# EAGLE board untitled (EAGLE 9.5.2), part 1 of 3
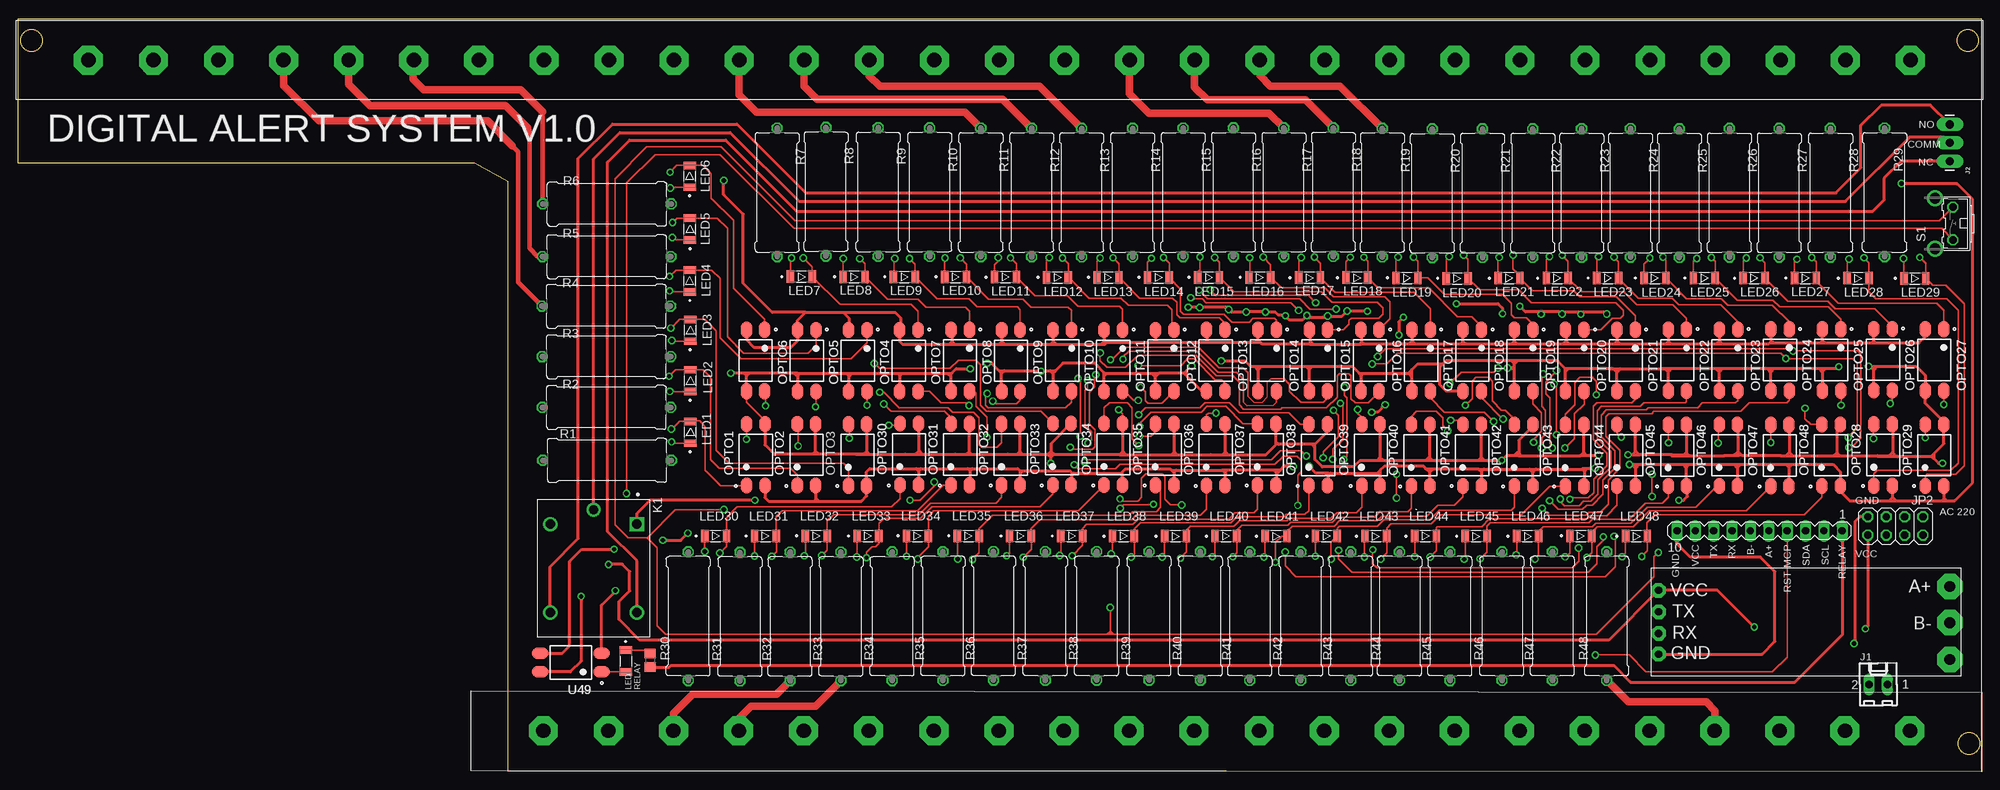
[diagram p1: board, top side]
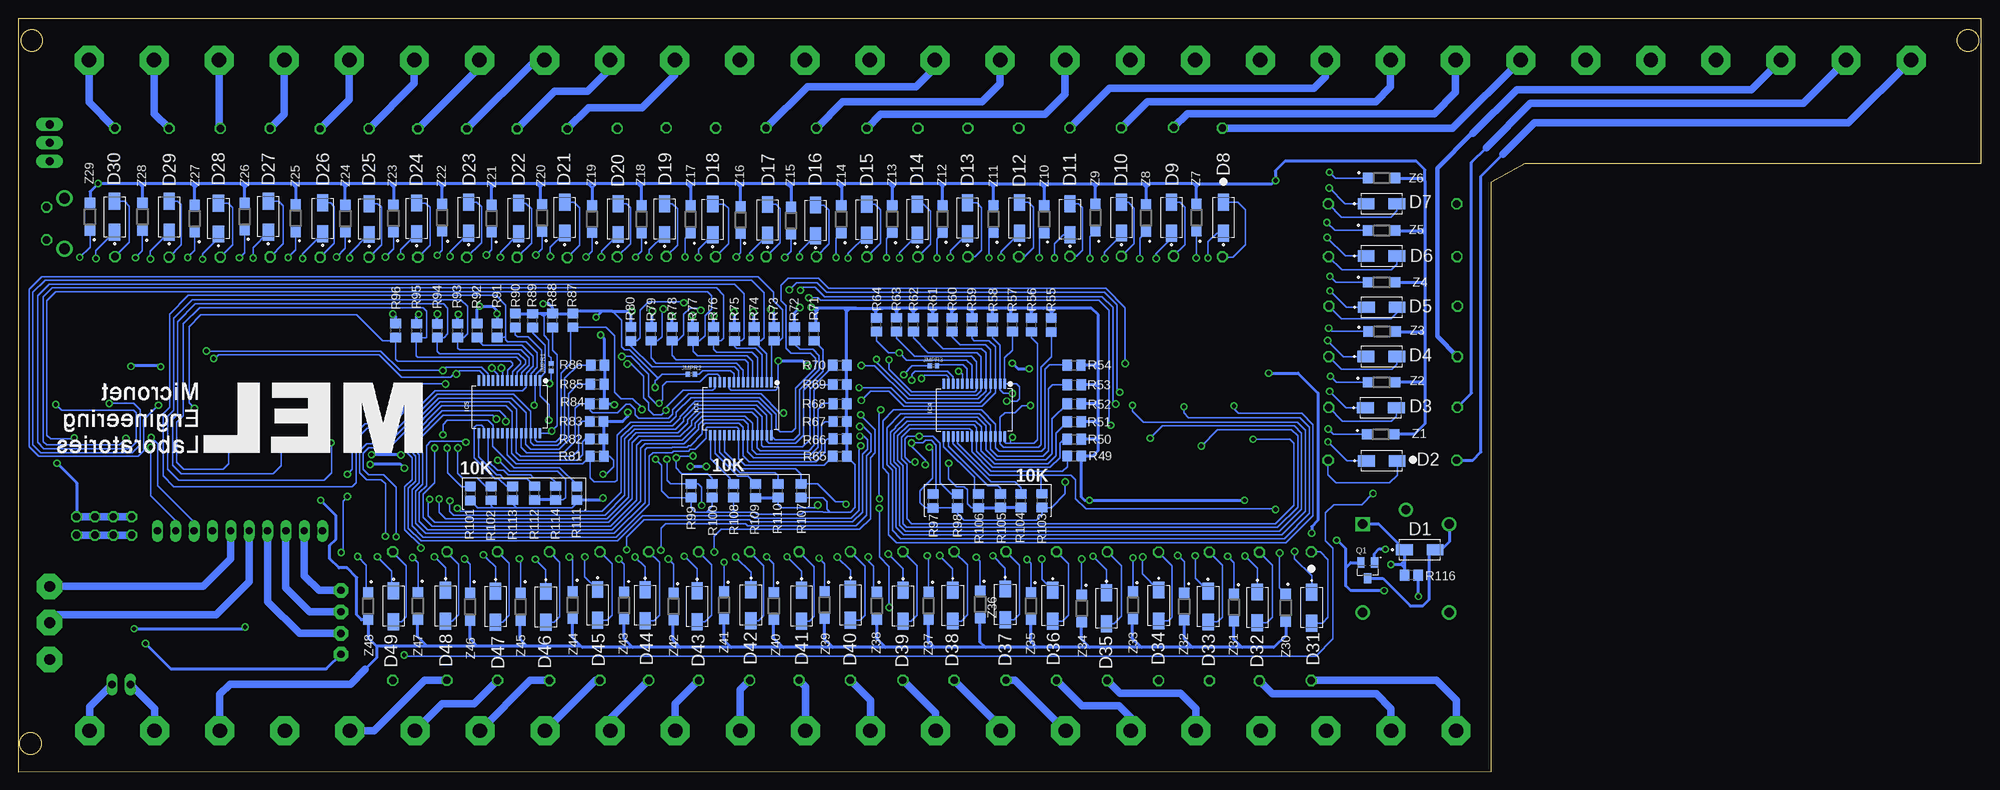
[diagram p2: board, bottom side, seen from below]

Size 271.53 x 104.18 mm. Coordinates in mm from the lower left corner, seen from the top.
Outline: 271.51,104.18 271.52,104.18
Outline: 0,104.13 271.53,104.13 271.53,0 67.78,0.08 67.81,81.59 63.11,84.1 0.02,84.1 0,104.13
Outline: circle at 269.84,3.87 radius 1.48
Outline: circle at 269.64,101.07 radius 1.48
Outline: circle at 1.84,101.07 radius 1.48
Copper layers (1*16): Top 0.035mm / dielectric 1.5mm / Bottom 0.035mm
Design rules "default *": minimum track width 6mil, minimum drill 0.35mm, track to track 0.3mm, track to pad 0.3mm, pad to pad 0.3mm, via to via 0.3mm, smd to smd 6mil, copper to edge 40mil, drill to drill 0.3mm, minimum pad ring 10mil, minimum via ring 8mil, stop-mask expansion 4mil, vias tented up to drill 25mil, thermal gap 10mil
Net classes: 0 default: drill 0.6 mm, clearance 0.3 mm

## Footprints (pad centres in the part's own frame; a part is rotated, then mirrored left to right if it is on the bottom)
DIOM5226X240N = smd 2.33 x 1.55: A 2.135,0; C -2.135,0
LEDC3216X120N = smd 1.01 x 1.73: + -1.51,0; - 1.51,0
HEADER-29P = drill 2 pad 4 octagon: 1 -109,16.5; 2 -100,16.5; 3 -91,16.5; 4 -82,16.5; 5 -73,16.5; 6 -64,16.5; 7 -55,16.5; 8 -46,16.5; 9 -37,16.5; 10 -28,16.5; 11 -19,16.5; 12 -10,16.5; 13 -1,16.5; 14 8,16.5; 15 17,16.5; 16 26,16.5; 17 35,16.5; 18 44,16.5; 19 53,16.5; 20 62,16.5; 21 71,16.5; 22 80,16.5
HEADER-29P' = drill 2 pad 4 octagon: 1 -116.62,5.07; 2 -107.62,5.07; 3 -98.62,5.07; 4 -89.62,5.07; 5 -80.62,5.07; 6 -71.62,5.07; 7 -62.62,5.07; 8 -53.62,5.07; 9 -44.62,5.07; 10 -35.62,5.07; 11 -26.62,5.07; 12 -17.62,5.07; 13 -8.62,5.07; 14 0.38,5.07; 15 9.38,5.07; 16 18.38,5.07; 17 27.38,5.07; 18 36.38,5.07; 19 45.38,5.07; 20 54.38,5.07; 21 63.38,5.07; 22 72.38,5.07; 23 81.38,5.07; 24 90.38,5.07; 25 99.38,5.07; 26 108.38,5.07; 27 117.38,5.07; 28 126.38,5.07; 29 135.38,5.07
SSOP28DB = smd 0.348 x 1.397: 1 -4.225,-3.656; 2 -3.575,-3.656; 3 -2.925,-3.656; 4 -2.275,-3.656; 5 -1.625,-3.656; 6 -0.975,-3.656; 7 -0.325,-3.656; 8 0.325,-3.656; 9 0.975,-3.656; 10 1.625,-3.656; 11 2.275,-3.656; 12 2.925,-3.656; 13 3.575,-3.656; 14 4.225,-3.656; 15 4.225,3.656; 16 3.575,3.656; 17 2.925,3.656; 18 2.275,3.656; 19 1.625,3.656; 20 0.975,3.656; 21 0.325,3.656; 22 -0.325,3.656; 23 -0.975,3.656; 24 -1.625,3.656; 25 -2.275,3.656; 26 -2.925,3.656; 27 -3.575,3.656; 28 -4.225,3.656
6410-02 = drill 1.016 long: 1 1.27,0; 2 -1.27,0
1X03_LONGPADS = drill 1.118 pad 1.88 long: 1 0,0; 2 2.54,0; 3 5.08,0
R0402 = smd 0.6 x 0.7: 1 -0.5,0; 2 0.5,0
2X04 = drill 1.016 octagon: 1 -3.81,-1.27; 2 -3.81,1.27; 3 -1.27,-1.27; 4 -1.27,1.27; 5 1.27,-1.27; 6 1.27,1.27; 7 3.81,-1.27; 8 3.81,1.27
RELAY_SRD-05VDC-SL-C = drill 1.32 square: A1 -6.1,6 | drill 1.32: A2 -6.1,-6; NC 6.1,6; NO 6.1,-6 | drill 1.29: COM -8.1,0
SOT254P975X400-4N = smd 2.25 x 1.6: 1 -4.25,1.27; 2 -4.25,-1.27; 3 4.25,-1.27; 4 4.25,1.27
SOT95P240X120-3N = smd 1 x 1.4: 1 -0.95,-1.1; 2 0.95,-1.1; 3 0,1.1
0617/17 = drill 1.016 octagon: 1 -8.89,0; 2 8.89,0
R0805 = smd 1.3 x 1.5: 1 -0.95,0; 2 0.95,0
B3F-31XX = drill 1.016 octagon: 1 -2.261,-1.245; 2 2.261,-1.245 | drill 1.499 pad 2.159: 3 -3.505,1.245; 4 3.505,1.245
MA10-1 = drill 1.016 long: 1 -11.43,0; 2 -8.89,0; 3 -6.35,0; 4 -3.81,0; 5 -1.27,0; 6 1.27,0; 7 3.81,0; 8 6.35,0; 9 8.89,0; 10 11.43,0
TTL-RS485 = drill 1.5 pad 3.5 octagon: A -19.7,-6; B -19.7,-1; P$7 -19.7,4.1 | drill 1 pad 2 octagon: GND 20.6,3.37; RX 20.581,0.505; TX 20.583,-2.493; VCC 20.6,-5.47
SOD123 = smd 1.4 x 1.4: A 1.9,0; C -1.9,0

## Placement (x,y rotation side)
D1  US1M-13  [DIOM5226X240N]  77.69,30.68 0 bottom
D2  US1M-13  [DIOM5226X240N]  82.93,42.95 0 bottom
D3  US1M-13  [DIOM5226X240N]  83.06,50.31 0 bottom
D4  US1M-13  [DIOM5226X240N]  82.98,57.39 0 bottom
D5  US1M-13  [DIOM5226X240N]  82.94,64.2 0 bottom
D6  US1M-13  [DIOM5226X240N]  82.96,71.29 0 bottom
D7  US1M-13  [DIOM5226X240N]  82.95,78.53 0 bottom
D8  US1M-13  [DIOM5226X240N]  104.82,76.59 90 bottom
D9  US1M-13  [DIOM5226X240N]  112,76.59 90 bottom
D10  US1M-13  [DIOM5226X240N]  118.95,76.59 90 bottom
D11  US1M-13  [DIOM5226X240N]  126.07,76.37 90 bottom
D12  US1M-13  [DIOM5226X240N]  133.03,76.55 90 bottom
D13  US1M-13  [DIOM5226X240N]  140.23,76.51 90 bottom
D14  US1M-13  [DIOM5226X240N]  147.16,76.32 90 bottom
D15  US1M-13  [DIOM5226X240N]  154.17,76.3 90 bottom
D16  US1M-13  [DIOM5226X240N]  161.24,76.2 90 bottom
D17  US1M-13  [DIOM5226X240N]  167.87,76.27 90 bottom
D18  US1M-13  [DIOM5226X240N]  175.46,76.34 90 bottom
D19  US1M-13  [DIOM5226X240N]  182.11,76.39 90 bottom
D20  US1M-13  [DIOM5226X240N]  188.54,76.39 90 bottom
D21  US1M-13  [DIOM5226X240N]  195.92,76.6 90 bottom
D22  US1M-13  [DIOM5226X240N]  202.31,76.48 90 bottom
D23  US1M-13  [DIOM5226X240N]  209.2,76.58 90 bottom
D24  US1M-13  [DIOM5226X240N]  216.42,76.48 90 bottom
D25  US1M-13  [DIOM5226X240N]  223,76.4 90 bottom
D26  US1M-13  [DIOM5226X240N]  229.42,76.5 90 bottom
D27  US1M-13  [DIOM5226X240N]  236.92,76.73 90 bottom
D28  US1M-13  [DIOM5226X240N]  243.83,76.47 90 bottom
D29  US1M-13  [DIOM5226X240N]  250.62,76.71 90 bottom
D30  US1M-13  [DIOM5226X240N]  258.19,76.7 90 bottom
D31  US1M-13  [DIOM5226X240N]  92.62,22.66 270 bottom
D32  US1M-13  [DIOM5226X240N]  100.15,22.7 270 bottom
D33  US1M-13  [DIOM5226X240N]  106.95,22.82 270 bottom
D34  US1M-13  [DIOM5226X240N]  113.78,22.96 270 bottom
D35  US1M-13  [DIOM5226X240N]  121.02,22.58 270 bottom
D36  US1M-13  [DIOM5226X240N]  128.43,22.94 270 bottom
D37  US1M-13  [DIOM5226X240N]  135.01,23.11 270 bottom
D38  US1M-13  [DIOM5226X240N]  142.27,22.95 270 bottom
D39  US1M-13  [DIOM5226X240N]  149.14,22.92 270 bottom
D40  US1M-13  [DIOM5226X240N]  156.43,23.05 270 bottom
D41  US1M-13  [DIOM5226X240N]  163.19,22.92 270 bottom
D42  US1M-13  [DIOM5226X240N]  170.19,23.01 270 bottom
D43  US1M-13  [DIOM5226X240N]  177.63,22.85 270 bottom
D44  US1M-13  [DIOM5226X240N]  184.83,23 270 bottom
D45  US1M-13  [DIOM5226X240N]  191.37,23.05 270 bottom
D46  US1M-13  [DIOM5226X240N]  198.54,22.77 270 bottom
D47  US1M-13  [DIOM5226X240N]  205.51,22.8 270 bottom
D48  US1M-13  [DIOM5226X240N]  212.42,22.92 270 bottom
D49  US1M-13  [DIOM5226X240N]  219.61,22.87 270 bottom
D146  LHN974_RED_LED_1206  [LEDC3216X120N]  84.03,15.28 270 top
HEADER-22P1  [HEADER-29P]  181.65,-10.85 0 top
HEADER-29P1  [HEADER-29P']  126.34,93.31 0 top
IC1  MCP23017SS  [SSOP28DB]  171.57,50.18 180 bottom
IC4  MCP23017SS  [SSOP28DB]  139.3,49.98 180 bottom
IC5  MCP23017SS  [SSOP28DB]  203.57,50.42 180 bottom
J1  22-27-2021-02  [6410-02]  257.26,12.06 0 top
J2  [1X03_LONGPADS]  267.16,84.39 90 top
JMPR1  [R0402]  197.83,55.9 270 bottom
JMPR2  [R0402]  178.42,54.94 0 bottom
JMPR3  [R0402]  144.94,56.11 0 bottom
JP2  [2X04]  259.64,33.96 0 top
K1  SRD-05VDC-SL-C  [RELAY_SRD-05VDC-SL-C]  79.6,28.1 270 top
LED1  LHN974_RED_LED_1206  [LEDC3216X120N]  92.95,46.9 90 top
LED2  LHN974_RED_LED_1206  [LEDC3216X120N]  92.96,54.06 90 top
LED3  LHN974_RED_LED_1206  [LEDC3216X120N]  92.95,61 90 top
LED4  LHN974_RED_LED_1206  [LEDC3216X120N]  92.9,67.84 90 top
LED5  LHN974_RED_LED_1206  [LEDC3216X120N]  92.92,75.01 90 top
LED6  LHN974_RED_LED_1206  [LEDC3216X120N]  92.88,82.29 90 top
LED7  LHN974_RED_LED_1206  [LEDC3216X120N]  108.32,68.43 0 top
LED8  LHN974_RED_LED_1206  [LEDC3216X120N]  115.62,68.42 0 top
LED9  LHN974_RED_LED_1206  [LEDC3216X120N]  122.57,68.39 0 top
LED10  LHN974_RED_LED_1206  [LEDC3216X120N]  129.65,68.4 0 top
LED11  LHN974_RED_LED_1206  [LEDC3216X120N]  136.56,68.36 0 top
LED12  LHN974_RED_LED_1206  [LEDC3216X120N]  143.74,68.34 0 top
LED13  LHN974_RED_LED_1206  [LEDC3216X120N]  150.74,68.34 0 top
LED14  LHN974_RED_LED_1206  [LEDC3216X120N]  157.71,68.34 0 top
LED15  LHN974_RED_LED_1206  [LEDC3216X120N]  164.65,68.34 0 top
LED16  LHN974_RED_LED_1206  [LEDC3216X120N]  171.73,68.34 0 top
LED17  LHN974_RED_LED_1206  [LEDC3216X120N]  178.6,68.3 0 top
LED18  LHN974_RED_LED_1206  [LEDC3216X120N]  185.16,68.3 0 top
LED19  LHN974_RED_LED_1206  [LEDC3216X120N]  192.07,68.26 0 top
LED20  LHN974_RED_LED_1206  [LEDC3216X120N]  199.02,68.19 0 top
LED21  LHN974_RED_LED_1206  [LEDC3216X120N]  206.19,68.23 0 top
LED22  LHN974_RED_LED_1206  [LEDC3216X120N]  212.86,68.23 0 top
LED23  LHN974_RED_LED_1206  [LEDC3216X120N]  219.84,68.24 0 top
LED24  LHN974_RED_LED_1206  [LEDC3216X120N]  226.37,68.25 0 top
LED25  LHN974_RED_LED_1206  [LEDC3216X120N]  233.2,68.24 0 top
LED26  LHN974_RED_LED_1206  [LEDC3216X120N]  240.09,68.22 0 top
LED27  LHN974_RED_LED_1206  [LEDC3216X120N]  247.18,68.25 0 top
LED28  LHN974_RED_LED_1206  [LEDC3216X120N]  254.46,68.21 0 top
LED29  LHN974_RED_LED_1206  [LEDC3216X120N]  262.34,68.19 0 top
LED30  LHN974_RED_LED_1206  [LEDC3216X120N]  96.48,32.57 0 top
LED31  LHN974_RED_LED_1206  [LEDC3216X120N]  103.36,32.57 0 top
LED32  LHN974_RED_LED_1206  [LEDC3216X120N]  110.39,32.59 0 top
LED33  LHN974_RED_LED_1206  [LEDC3216X120N]  117.54,32.57 0 top
LED34  LHN974_RED_LED_1206  [LEDC3216X120N]  124.38,32.59 0 top
LED35  LHN974_RED_LED_1206  [LEDC3216X120N]  131.42,32.6 0 top
LED36  LHN974_RED_LED_1206  [LEDC3216X120N]  138.62,32.58 0 top
LED37  LHN974_RED_LED_1206  [LEDC3216X120N]  145.72,32.57 0 top
LED38  LHN974_RED_LED_1206  [LEDC3216X120N]  152.86,32.55 0 top
LED39  LHN974_RED_LED_1206  [LEDC3216X120N]  160.08,32.56 0 top
LED40  LHN974_RED_LED_1206  [LEDC3216X120N]  167.03,32.56 0 top
LED41  LHN974_RED_LED_1206  [LEDC3216X120N]  173.99,32.55 0 top
LED42  LHN974_RED_LED_1206  [LEDC3216X120N]  180.94,32.56 0 top
LED43  LHN974_RED_LED_1206  [LEDC3216X120N]  187.77,32.55 0 top
LED44  LHN974_RED_LED_1206  [LEDC3216X120N]  194.64,32.56 0 top
LED45  LHN974_RED_LED_1206  [LEDC3216X120N]  201.65,32.56 0 top
LED46  LHN974_RED_LED_1206  [LEDC3216X120N]  208.76,32.56 0 top
LED47  LHN974_RED_LED_1206  [LEDC3216X120N]  216.11,32.6 0 top
LED48  LHN974_RED_LED_1206  [LEDC3216X120N]  223.82,32.56 0 top
OPTO1  PC817X2NIP0F  [SOT254P975X400-4N]  102.04,43.8 90 top
OPTO2  PC817X2NIP0F  [SOT254P975X400-4N]  109.04,43.82 90 top
OPTO3  PC817X2NIP0F  [SOT254P975X400-4N]  116.1,43.78 90 top
OPTO4  PC817X2NIP0F  [SOT254P975X400-4N]  116.12,56.81 270 top
OPTO5  PC817X2NIP0F  [SOT254P975X400-4N]  109.06,56.82 270 top
OPTO6  PC817X2NIP0F  [SOT254P975X400-4N]  101.99,56.83 270 top
OPTO7  PC817X2NIP0F  [SOT254P975X400-4N]  123.19,56.82 270 top
OPTO8  PC817X2NIP0F  [SOT254P975X400-4N]  130.28,56.83 270 top
OPTO9  PC817X2NIP0F  [SOT254P975X400-4N]  137.31,56.82 270 top
OPTO10  PC817X2NIP0F  [SOT254P975X400-4N]  144.4,56.83 270 top
OPTO11  PC817X2NIP0F  [SOT254P975X400-4N]  151.47,56.82 270 top
OPTO12  PC817X2NIP0F  [SOT254P975X400-4N]  158.56,56.83 270 top
OPTO13  PC817X2NIP0F  [SOT254P975X400-4N]  165.64,56.84 270 top
OPTO14  PC817X2NIP0F  [SOT254P975X400-4N]  172.75,56.84 270 top
OPTO15  PC817X2NIP0F  [SOT254P975X400-4N]  179.84,56.83 270 top
OPTO16  PC817X2NIP0F  [SOT254P975X400-4N]  186.96,56.83 270 top
OPTO17  PC817X2NIP0F  [SOT254P975X400-4N]  194.03,56.84 270 top
OPTO18  PC817X2NIP0F  [SOT254P975X400-4N]  201.12,56.85 270 top
OPTO19  PC817X2NIP0F  [SOT254P975X400-4N]  208.2,56.85 270 top
OPTO20  PC817X2NIP0F  [SOT254P975X400-4N]  215.28,56.85 270 top
OPTO21  PC817X2NIP0F  [SOT254P975X400-4N]  222.37,56.84 270 top
OPTO22  PC817X2NIP0F  [SOT254P975X400-4N]  229.48,56.86 270 top
OPTO23  PC817X2NIP0F  [SOT254P975X400-4N]  236.55,56.88 270 top
OPTO24  PC817X2NIP0F  [SOT254P975X400-4N]  243.67,56.91 270 top
OPTO25  PC817X2NIP0F  [SOT254P975X400-4N]  250.79,56.9 270 top
OPTO26  PC817X2NIP0F  [SOT254P975X400-4N]  257.91,56.93 270 top
OPTO27  PC817X2NIP0F  [SOT254P975X400-4N]  265.03,56.92 270 top
OPTO28  PC817X2NIP0F  [SOT254P975X400-4N]  257.95,43.78 90 top
OPTO29  PC817X2NIP0F  [SOT254P975X400-4N]  265.03,43.76 90 top
OPTO30  PC817X2NIP0F  [SOT254P975X400-4N]  123.23,43.86 90 top
OPTO31  PC817X2NIP0F  [SOT254P975X400-4N]  130.29,43.85 90 top
OPTO32  PC817X2NIP0F  [SOT254P975X400-4N]  137.3,43.85 90 top
OPTO33  PC817X2NIP0F  [SOT254P975X400-4N]  144.37,43.88 90 top
OPTO34  PC817X2NIP0F  [SOT254P975X400-4N]  151.48,43.87 90 top
OPTO35  PC817X2NIP0F  [SOT254P975X400-4N]  158.58,43.85 90 top
OPTO36  PC817X2NIP0F  [SOT254P975X400-4N]  165.64,43.82 90 top
OPTO37  PC817X2NIP0F  [SOT254P975X400-4N]  172.69,43.84 90 top
OPTO38  PC817X2NIP0F  [SOT254P975X400-4N]  179.79,43.79 90 top
OPTO39  PC817X2NIP0F  [SOT254P975X400-4N]  187.1,43.78 90 top
OPTO40  PC817X2NIP0F  [SOT254P975X400-4N]  193.96,43.73 90 top
OPTO41  PC817X2NIP0F  [SOT254P975X400-4N]  201.09,43.75 90 top
OPTO42  PC817X2NIP0F  [SOT254P975X400-4N]  208.21,43.72 90 top
OPTO43  PC817X2NIP0F  [SOT254P975X400-4N]  215.25,43.71 90 top
OPTO44  PC817X2NIP0F  [SOT254P975X400-4N]  222.41,43.72 90 top
OPTO45  PC817X2NIP0F  [SOT254P975X400-4N]  229.48,43.72 90 top
OPTO46  PC817X2NIP0F  [SOT254P975X400-4N]  236.53,43.72 90 top
OPTO47  PC817X2NIP0F  [SOT254P975X400-4N]  243.66,43.71 90 top
OPTO48  PC817X2NIP0F  [SOT254P975X400-4N]  250.73,43.75 90 top
Q1  S9013  [SOT95P240X120-3N]  84.88,27.81 180 bottom
R1  [0617/17]  81.46,43.04 0 top
R2  [0617/17]  81.37,50.35 0 top
R3  [0617/17]  81.37,57.38 0 top
R4  [0617/17]  81.34,64.36 0 top
R5  [0617/17]  81.4,71.21 0 top
R6  [0617/17]  81.45,78.48 0 top
R7  [0617/17]  104.97,80.08 270 top
R8  [0617/17]  111.73,80.18 270 top
R9  [0617/17]  118.94,80.13 270 top
R10  [0617/17]  126.08,80.11 270 top
R11  [0617/17]  133.14,80.08 270 top
R12  [0617/17]  140.18,80.07 270 top
R13  [0617/17]  147.09,80.05 270 top
R14  [0617/17]  154.14,80.06 270 top
R15  [0617/17]  161.13,80.09 270 top
R16  [0617/17]  168.08,80.1 270 top
R17  [0617/17]  175.05,80.1 270 top
R18  [0617/17]  181.9,80.11 270 top
R19  [0617/17]  188.67,80.05 270 top
R20  [0617/17]  195.57,79.97 270 top
R21  [0617/17]  202.52,79.98 270 top
R22  [0617/17]  209.48,79.98 270 top
R23  [0617/17]  216.24,80 270 top
R24  [0617/17]  222.99,80.01 270 top
R25  [0617/17]  229.75,79.99 270 top
R26  [0617/17]  236.68,80.04 270 top
R27  [0617/17]  243.56,80.04 270 top
R28  [0617/17]  250.67,80.03 270 top
R29  [0617/17]  258.13,80.09 270 top
R30  [0617/17]  92.68,21.48 90 top
R31  [0617/17]  99.85,21.43 90 top
R32  [0617/17]  106.77,21.45 90 top
R33  [0617/17]  113.8,21.47 90 top
R34  [0617/17]  120.89,21.48 90 top
R35  [0617/17]  127.91,21.51 90 top
R36  [0617/17]  134.9,21.52 90 top
R37  [0617/17]  142.06,21.52 90 top
R38  [0617/17]  149.17,21.52 90 top
R39  [0617/17]  156.42,21.52 90 top
R40  [0617/17]  163.52,21.51 90 top
R41  [0617/17]  170.35,21.5 90 top
R42  [0617/17]  177.41,21.49 90 top
R43  [0617/17]  184.32,21.5 90 top
R44  [0617/17]  191.07,21.49 90 top
R45  [0617/17]  198.04,21.48 90 top
R46  [0617/17]  205.23,21.5 90 top
R47  [0617/17]  212.21,21.51 90 top
R48  [0617/17]  219.7,21.5 90 top
R49  [R0805]  125.46,43.62 0 bottom
R50  [R0805]  125.47,45.96 0 bottom
R51  [R0805]  125.47,48.37 0 bottom
R52  [R0805]  125.47,50.85 0 bottom
R53  [R0805]  125.47,53.5 0 bottom
R54  [R0805]  125.48,56.19 0 bottom
R55  [R0805]  128.64,61.75 90 bottom
R56  [R0805]  131.37,61.77 90 bottom
R57  [R0805]  134.02,61.8 90 bottom
R58  [R0805]  136.77,61.8 90 bottom
R59  [R0805]  139.62,61.8 90 bottom
R60  [R0805]  142.35,61.8 90 bottom
R61  [R0805]  145.03,61.8 90 bottom
R62  [R0805]  147.71,61.8 90 bottom
R63  [R0805]  150.06,61.81 90 bottom
R64  [R0805]  152.8,61.79 90 bottom
R65  [R0805]  157.89,43.62 0 bottom
R66  [R0805]  157.87,46 0 bottom
R67  [R0805]  157.88,48.4 0 bottom
R68  [R0805]  157.87,50.88 0 bottom
R69  [R0805]  157.89,53.52 0 bottom
R70  [R0805]  157.89,56.17 0 bottom
R71  [R0805]  161.45,60.52 90 bottom
R72  [R0805]  164.13,60.52 90 bottom
R73  [R0805]  167,60.52 90 bottom
R74  [R0805]  169.73,60.52 90 bottom
R75  [R0805]  172.44,60.51 90 bottom
R76  [R0805]  175.37,60.51 90 bottom
R77  [R0805]  178.18,60.51 90 bottom
R78  [R0805]  181.11,60.52 90 bottom
R79  [R0805]  184.01,60.51 90 bottom
R80  [R0805]  186.8,60.51 90 bottom
R81  [R0805]  191.47,43.6 0 bottom
R82  [R0805]  191.52,45.99 0 bottom
R83  [R0805]  191.52,48.41 0 bottom
R84  [R0805]  191.48,50.85 0 bottom
R85  [R0805]  191.44,53.54 0 bottom
R86  [R0805]  191.39,56.2 0 bottom
R87  [R0805]  194.8,62.39 90 bottom
R88  [R0805]  197.62,62.38 90 bottom
R89  [R0805]  200.38,62.36 90 bottom
R90  [R0805]  202.76,62.37 90 bottom
R91  [R0805]  205.3,60.98 90 bottom
R92  [R0805]  208.06,60.98 90 bottom
R93  [R0805]  210.72,60.97 90 bottom
R94  [R0805]  213.55,60.96 90 bottom
R95  [R0805]  216.43,60.96 90 bottom
R96  [R0805]  219.3,61 90 bottom
R97  [R0805]  144.98,37.4 270 bottom
R98  [R0805]  141.6,37.4 270 bottom
R99  [R0805]  178.47,38.83 270 bottom
R100  [R0805]  175.54,38.82 270 bottom
R101  [R0805]  208.97,38.44 270 bottom
R102  [R0805]  206.13,38.47 270 bottom
R103  [R0805]  129.92,37.46 90 bottom
R104  [R0805]  132.82,37.45 90 bottom
R105  [R0805]  135.67,37.44 90 bottom
R106  [R0805]  138.7,37.43 90 bottom
R107  [R0805]  163.26,38.82 270 bottom
R108  [R0805]  172.56,38.83 90 bottom
R109  [R0805]  169.54,38.81 90 bottom
R110  [R0805]  166.44,38.82 90 bottom
R111  [R0805]  194.25,38.49 90 bottom
R112  [R0805]  200.07,38.5 90 bottom
R113  [R0805]  203.13,38.48 90 bottom
R114  [R0805]  197.2,38.5 90 bottom
R115  [R0805]  87.41,15.4 270 top
R116  [R0805]  78.84,27.14 180 bottom
S1  [B3F-31XX]  266.35,75.78 90 top
SV1  [MA10-1]  240.85,33.29 180 top
TTL-RS1  [TTL-RS485]  247.48,19.6 180 top
U49  PC817X2NIP0F  [SOT254P975X400-4N]  76.45,15.07 180 top
Z1  [SOD123]  83.09,46.63 0 bottom
Z2  [SOD123]  82.96,53.84 0 bottom
Z3  [SOD123]  82.9,60.85 0 bottom
Z4  [SOD123]  82.96,67.66 0 bottom
Z5  [SOD123]  82.97,74.82 0 bottom
Z6  [SOD123]  82.95,82.06 0 bottom
Z7  [SOD123]  108.55,76.58 90 bottom
Z8  [SOD123]  115.52,76.55 90 bottom
Z9  [SOD123]  122.53,76.6 90 bottom
Z10  [SOD123]  129.61,76.37 90 bottom
Z11  [SOD123]  136.66,76.38 90 bottom
Z12  [SOD123]  143.66,76.38 90 bottom
Z13  [SOD123]  150.62,76.39 90 bottom
Z14  [SOD123]  157.67,76.37 90 bottom
Z15  [SOD123]  164.63,76.18 90 bottom
Z16  [SOD123]  171.63,76.27 90 bottom
Z17  [SOD123]  178.51,76.36 90 bottom
Z18  [SOD123]  185.32,76.37 90 bottom
Z19  [SOD123]  192.15,76.39 90 bottom
Z20  [SOD123]  199.08,76.57 90 bottom
Z21  [SOD123]  206.03,76.47 90 bottom
Z22  [SOD123]  212.88,76.6 90 bottom
Z23  [SOD123]  219.62,76.48 90 bottom
Z24  [SOD123]  226.26,76.47 90 bottom
Z25  [SOD123]  233.14,76.51 90 bottom
Z26  [SOD123]  240.19,76.74 90 bottom
Z27  [SOD123]  247.12,76.46 90 bottom
Z28  [SOD123]  254.33,76.71 90 bottom
Z29  [SOD123]  261.59,76.71 90 bottom
Z30  [SOD123]  96.22,22.65 270 bottom
Z31  [SOD123]  103.36,22.71 270 bottom
Z32  [SOD123]  110.25,22.82 270 bottom
Z33  [SOD123]  117.34,22.99 270 bottom
Z34  [SOD123]  124.44,22.56 270 bottom
Z35  [SOD123]  131.47,22.92 270 bottom
Z36  [SOD123]  138.47,23.11 270 bottom
Z37  [SOD123]  145.61,22.92 270 bottom
Z38  [SOD123]  152.77,22.93 270 bottom
Z39  [SOD123]  159.99,23.06 270 bottom
Z40  [SOD123]  167.02,22.9 270 bottom
Z41  [SOD123]  173.89,23 270 bottom
Z42  [SOD123]  180.88,22.85 270 bottom
Z43  [SOD123]  187.71,22.99 270 bottom
Z44  [SOD123]  194.83,23.04 270 bottom
Z45  [SOD123]  202.02,22.79 270 bottom
Z46  [SOD123]  209.02,22.79 270 bottom
Z47  [SOD123]  216.24,22.91 270 bottom
Z48  [SOD123]  223.14,22.89 270 bottom

## Tracks (layer width: path | path; a pad name or v marks a point on that pad's centre or on a via)
A+
  Bottom 1.016: TTL-RS1.A 245.93,25.6 242.12,29.41 SV1.5
B-
  Bottom 1.016: TTL-RS1.B 266.11,21.67 244.15,21.67 239.58,26.24 SV1.6
COMM  (via drill 0.6)
  Top 0.406: OPTO6.2 100.72,59.71 101.74,58.7 106.92,58.7 107.88,59.66 107.88,60.98 OPTO5.2 107.79,62.39 108.9,63.5 | 108.9,63.5 114.08,63.5 | 114.08,63.5 114.89,62.68 114.89,61.11 OPTO4.2 | 114.08,63.5 121.3,63.5 122.06,62.73 122.06,61.21 OPTO7.2 121.92,59.49 122.34,59.08 128.74,59.08 | 128.74,59.08 129.02,59.08 | 129.02,59.08 129.14,59.2 129.14,59.48 | 129.14,59.48 129.14,60.95 OPTO8.2 | 129.02,59.08 129.55,59.08 | 129.55,59.08 135.65,59.08 | 135.65,59.08 136.05,59.08 | 136.05,59.08 136.08,59.1 136.08,59.51 | 136.08,59.51 136.08,61.03 OPTO9.2 | 136.05,59.08 136.51,59.08 | 136.51,59.08 142.76,59.08 | 142.76,59.08 143.19,59.08 | 143.19,59.08 143.16,59.05 143.6,59.05 | 143.19,59.08 143.19,59.46 | 143.19,59.46 143.19,61.02 OPTO10.2 | 143.6,59.05 149.77,59.05 | 149.77,59.05 150.07,59.05 | OPTO12.2 157.36,61 157.36,59.73 | 164.16,59.32 164.4,59.56 | 164.4,59.56 164.4,61.05 OPTO13.2 | 171.84,59.32 171.48,59.32 | 171.48,59.32 171.05,59.32 | 171.05,59.32 164.64,59.32 | 164.64,59.32 164.16,59.32 | 178.67,59.41 178.67,60.97 OPTO15.2 | 178.67,59.41 178.67,59.1 | 185.81,59.36 185.62,59.17 185.68,59.1 179.08,59.1 | 185.81,59.36 185.81,59.13 186.14,59.13 | 185.81,59.46 185.81,60.96 OPTO16.2 | 185.81,59.46 185.81,59.36 | 186.14,59.13 192.44,59.13 | 192.44,59.13 193.25,59.13 | 192.85,59.53 192.85,61.01 OPTO17.2 | 193.25,59.13 199.52,59.13 | 199.52,59.13 199.78,59.13 | 199.85,59.46 199.85,59.2 199.78,59.13 | 199.85,59.46 OPTO18.2 | 199.78,59.13 200.18,59.13 | 200.18,59.13 206.6,59.13 | 206.6,59.13 206.89,59.13 | 206.93,59.46 206.93,59.17 206.89,59.13 | 206.93,59.46 OPTO19.2 | 206.89,59.13 207.26,59.13 | 207.26,59.13 213.73,59.13 | 213.73,59.13 214.11,59.51
  Top 0.406: 214.11,59.51 214.11,61 OPTO20.2 | 213.73,59.13 214.49,59.13 | 214.49,59.13 220.76,59.13 | 220.76,59.13 221.14,59.13 | 221.14,59.13 221.14,59.51 | 221.14,59.51 221.14,61.05 OPTO21.2 | 221.14,59.13 221.52,59.13 | 221.52,59.13 227.9,59.13 | 227.9,59.13 228.23,59.13 | 228.23,59.13 228.23,59.46 | 228.23,59.46 228.23,61.09 OPTO22.2 | 228.23,59.13 228.56,59.13 | 228.56,59.13 234.96,59.13 | 234.96,59.13 235.72,59.13 | 235.34,59.51 235.34,61.08 OPTO23.2 | 235.72,59.13 242.12,59.13 242.26,59.27 | 242.26,59.27 242.43,59.43 242.43,59.66 | 242.43,59.66 242.43,61.13 OPTO24.2 | 242.26,59.27 242.82,59.27 | 242.82,59.27 249.24,59.27 | 249.24,59.27 249.54,59.27 | 249.54,59.27 249.54,59.51 | 249.54,59.51 249.54,61.13 OPTO25.2 | 249.54,59.27 249.84,59.27 | 249.84,59.27 256.35,59.27 | 256.35,59.27 256.56,59.27 | 256.64,59.56 256.64,59.34 256.56,59.27 | 256.64,59.56 OPTO26.2 | 256.56,59.27 256.93,59.27 | 256.93,59.27 262.89,59.27 263.76,60.14 OPTO27.2 | OPTO1.2 103.31,37.87 103.77,37.41 110.09,37.41 | 110.35,37.66 110.42,37.74 110.75,37.41 | 110.35,37.66 110.35,39.53 OPTO2.2 | 110.09,37.41 110.75,37.41 | 110.75,37.41 116.65,37.41 117.37,38.14 OPTO3.2 117.37,41.46 117.79,41.88 124.22,41.88 | 124.22,41.88 124.55,41.55 | 124.55,41.55 124.55,39.66 OPTO30.2 | 124.22,41.88 124.88,41.88 | 124.88,41.88 131.35,41.88 | 131.35,41.88 131.63,41.6 | 131.63,41.6 131.63,39.68 OPTO31.2 | 131.35,41.88 131.99,41.88 | 131.99,41.88 138.26,41.88 138.58,41.57 | 138.58,41.57 138.59,41.55 138.59,41.21 | 138.59,41.21 138.59,39.62 OPTO32.2 | 138.58,41.57 138.95,41.57 | 138.95,41.57 145.51,41.57 145.7,41.37 | 145.7,41.37 145.81,41.27 146,41.27 | 145.7,41.37 145.7,40.97
  Top 0.406: 145.7,40.97 145.7,39.69 OPTO33.2 | 159.53,41.65 159.56,41.65 159.53,41.68 160.18,41.68 | 159.86,41.33 OPTO35.2 | 159.53,41.65 159.4,41.78 153.07,41.78 152.75,41.46 | 159.53,41.65 159.86,41.33 | 160.18,41.68 166.56,41.68 | 166.56,41.68 166.53,41.7 167.29,41.7 | 166.56,41.68 166.99,41.25 | 166.99,41.25 166.99,39.65 OPTO36.2 | 167.29,41.7 173.64,41.7 | 173.64,41.7 174,41.35 174,41.09 | 174,41.09 174,39.63 OPTO37.2 | 181.19,41.27 181.19,40.95 | 181.19,40.92 181.19,39.67 OPTO38.2 | 188.37,41.27 188.06,41.27 | 181.19,41.27 181.52,41.27 | 181.52,41.27 188.02,41.27 | 188.37,41.62 188.37,41.27 | 188.37,41.27 188.37,40.97 | 188.37,40.97 OPTO39.2 | OPTO40.2 195.23,41.38 | 194.78,41.83 194.4,42.21 188.94,42.21 188.37,41.64 188.37,41.62 | 194.78,41.83 195.23,41.38 | 201.99,41.83 195.64,41.83 | 195.64,41.83 194.78,41.83 | 201.99,41.83 202.42,41.4 | 202.42,41.4 202.42,39.56 OPTO41.2 | 201.99,41.83 202.75,41.83 | 202.75,41.83 209.03,41.83 | 209.03,41.83 209.51,41.35 | 209.51,41.35 209.51,39.5 OPTO42.2 | 209.03,41.83 209.92,41.83 | 209.92,41.83 216.32,41.83 | 216.32,41.83 216.37,41.83 216.34,41.86 216.93,41.86 | 216.32,41.83 216.6,41.55 216.6,41.53 | 216.6,41.53 216.6,39.54 OPTO43.2 | 223.68,42.03 223.25,42.47 v222.84,42.47 224.14,42.47 | 223.68,42.03 OPTO44.2 | 224.14,42.47 230.29,42.47 | 230.75,42 OPTO45.2 230.87,39.35 230.87,38.05 230.34,37.51 v229.68,37.51 | 230.29,42.47 230.75,42 | 230.29,42.47 231.15,42.47 | 231.15,42.47 237.37,42.47 | 237.8,42.04 OPTO46.2 | 237.37,42.47 237.8,42.04 | 237.37,42.47 238.21,42.47 | 238.21,42.47 244.51,42.47 | 244.93,42.05 OPTO47.2 | 244.51,42.47 244.93,42.05 | 244.51,42.47 245.37,42.47 | 245.37,42.47 251.01,42.47 252,41.47 OPTO48.2 252,38.76 253.3,37.46 258.81,37.46
  Top 0.406: 258.81,37.46 259.27,37.92 | 259.27,37.92 259.27,39.48 OPTO28.2 | 258.81,37.46 259.75,37.46 | 259.75,37.46 266.05,37.46 | 266.38,37.79 266.05,37.46 | 266.38,37.79 266.38,39.42 OPTO29.2 | 108.9,63.5 104.3,63.5 100.29,67.51 100.29,77.09 97.6,79.78 97.6,81.71 v97.62,81.73 | 266.05,37.46 266.71,37.46 | 266.71,37.46 267.83,37.46 270.31,39.95 270.31,79.12 268.16,81.28 260.46,81.28 v260.46,81.3 | 178.67,59.1 179.08,59.1 | v218.1,41.96 218,41.86 216.93,41.86 | 181.19,41.27 180.84,41.27 | 180.84,41.27 179.48,41.27 v178.57,42.19 | v176.34,42.19 175.09,42.19 174.6,41.69 | 174.6,41.69 174,41.09 | 146,41.27 152.56,41.27 | OPTO34.2 152.75,40.97 | 152.75,40.97 152.75,41.46 | 152.75,41.46 152.56,41.27 | 156.95,59.32 157.36,59.73 | 164.16,59.32 157.68,59.32 | 157.68,59.32 156.95,59.32 | 157.68,59.32 157.36,59.64 157.36,59.73 | 256.93,59.27 256.64,59.56 | 256.64,59.56 | 256.64,59.56 256.35,59.27 | 249.54,59.51 249.6,59.51 249.84,59.27 | 249.54,59.51 249.48,59.51 249.24,59.27 | 242.82,59.27 242.43,59.66 | 235.72,59.13 235.34,59.51 | 234.96,59.13 235.34,59.51 | 228.23,59.46 228.56,59.13 | 228.23,59.46 227.9,59.13 | 221.14,59.51 221.52,59.13 | 221.14,59.51 220.76,59.13 | 214.11,59.51 214.49,59.13 | 206.93,59.46 207.26,59.13 | 206.6,59.13 206.93,59.46 | 199.85,59.46 200.18,59.13 | 199.52,59.13 199.85,59.46 | 193.25,59.13 192.85,59.53 | 192.44,59.13 192.85,59.53 | 186.14,59.13 185.81,59.46 | 178.67,59.41 178.78,59.41 179.08,59.1 | 178.67,59.1 172.06,59.1 171.84,59.32 | 171.48,59.32 171.48,59.68 | 171.48,59.75 OPTO14.2 | 171.05,59.32 171.48,59.75 | 171.84,59.32 171.48,59.68 | 171.48,59.68 171.48,59.75 | 164.4,59.56 164.64,59.32 | OPTO11.2 150.2,59.66 | 150.2,59.49 150.2,59.18 150.07,59.05
  Top 0.406: 156.95,59.32 150.54,59.32 | 150.54,59.32 150.2,59.66 | 150.07,59.05 150.27,59.05 150.54,59.32 | 150.2,59.66 150.2,59.49 | 150.2,59.49 149.77,59.05 | 143.6,59.05 143.19,59.46 | 142.76,59.08 143.14,59.46 143.19,59.46 | 135.65,59.08 136.08,59.51 | 136.08,59.51 136.51,59.08 | 129.14,59.48 128.74,59.08 | 129.14,59.48 129.55,59.08 | 124.55,41.55 124.88,41.88 | 131.63,41.6 131.71,41.6 131.99,41.88 | 138.59,41.21 138.95,41.57 | 145.7,40.97 146,41.27 | 152.75,40.97 152.56,41.16 152.56,41.27 | 159.86,41.33 160.18,41.66 160.18,41.68 | 166.99,41.25 166.99,41.4 167.29,41.7 | 216.6,41.53 216.93,41.86 | 209.51,41.35 209.51,41.42 209.92,41.83 | 202.42,41.4 202.42,41.5 202.75,41.83 | 195.23,41.38 195.23,41.42 195.64,41.83 | 188.37,40.97 188.06,41.27 | 188.06,41.27 188.02,41.27 | 188.02,41.27 188.37,41.62 | 181.19,40.92 181.19,40.95 | 181.19,40.95 181.52,41.27 | 181.19,40.92 180.84,41.27 | 223.68,42.03 223.71,42.03 224.14,42.47 | 230.75,42 230.75,42.06 231.15,42.47 | 237.8,42.04 238.21,42.45 238.21,42.47 | 244.93,42.05 244.96,42.05 245.37,42.47 | 259.27,37.92 259.29,37.92 259.75,37.46 | 266.71,37.46 266.38,37.79 | 110.09,37.41 110.35,37.66 | 173.64,41.7 174.58,41.7 174.6,41.69
  Bottom 0.406: Z7.A 108.55,80.85 | 108.55,80.85 109,81.3 | 109,81.3 115.02,81.3 | 115.02,81.3 115.53,80.79 | 115.53,80.79 Z8.A | Z9.A 122.53,80.85 | 122.08,81.3 115.99,81.3 | 115.99,81.3 115.02,81.3 | 122.53,80.85 122.08,81.3 | Z10.A 129.61,80.86 | 129.17,81.3 129.61,80.86 | 129.17,81.3 122.98,81.3 | 122.98,81.3 122.08,81.3 | Z11.A 136.66,80.88 | 136.23,81.3 136.66,80.88 | 136.23,81.3 130.11,81.3 | 130.11,81.3 129.17,81.3 | Z12.A 143.66,80.84 | 143.66,80.84 143.66,80.9 143.27,81.3 | 136.23,81.3 137.12,81.3 | 137.12,81.3 143.27,81.3 | 143.27,81.3 144.13,81.3 | 144.13,81.3 150.15,81.3 | Z13.A 150.62,80.83 | 150.62,80.83 150.15,81.3 | 150.15,81.3 151.1,81.3 | 151.1,81.3 157.21,81.3 | 157.67,80.84 Z14.A | 157.21,81.3 157.67,80.84 | 157.21,81.3 158.2,81.3 | 158.2,81.3 164.3,81.3 | 164.3,81.3 164.65,80.95 164.65,80.79 | 164.65,80.79 164.65,78.11 Z15.A | 164.3,81.3 165.16,81.3 | 165.16,81.3 171.23,81.3 | 171.23,81.3 171.66,80.87 | 171.66,80.87 171.66,78.2 Z16.A | 171.23,81.3 172.12,81.3 | 172.12,81.3 178.17,81.3 | 178.17,81.3 178.52,80.95 178.52,80.74 | 178.52,80.74 178.52,78.28 Z17.A | 178.17,81.3 179.08,81.3 | 179.08,81.3 185,81.3 | 185,81.3 185.35,80.95 | 185.35,80.95 185.35,78.3 Z18.A | 185,81.3 185.89,81.3 | 185.89,81.3 191.6,81.3 | 192.16,80.75 Z19.A | 191.6,81.3 192.16,80.75 | 191.6,81.3 192.69,81.3 | 192.69,81.3 198.84,81.3 | 198.84,81.3 199.35,80.79 | 199.35,80.79 199.35,78.74 Z20.A | 198.84,81.3 199.81,81.3 | 199.81,81.3 205.5,81.3 | Z21.A 206.03,80.77 | 205.5,81.3 206.03,80.77 | 205.5,81.3 206.41,81.3 | 206.41,81.3 212.43,81.3 | Z22.A 212.88,80.85 | 212.43,81.3 212.88,80.85 | 212.43,81.3 213.33,81.3 | 213.33,81.3 219.19,81.3 | 219.62,80.87 Z23.A | 219.19,81.3 219.62,80.87 | 219.19,81.3 220.08,81.3
  Bottom 0.406: 220.08,81.3 225.84,81.3 | Z24.A 226.26,80.88 | 225.84,81.3 226.26,80.88 | 225.84,81.3 226.69,81.3 | 226.69,81.3 232.73,81.3 | 232.73,81.3 233.16,80.87 | 233.16,80.87 233.16,78.42 Z25.A | 232.73,81.3 233.64,81.3 | 233.64,81.3 239.66,81.3 | Z26.A 240.19,80.77 | 239.66,81.3 240.19,80.77 | 239.66,81.3 240.65,81.3 | 240.65,81.3 246.52,81.3 | Z27.A 247.12,80.7 | 246.52,81.3 247.12,80.7 | 246.52,81.3 247.41,81.3 | 247.41,81.3 247.61,81.3 | 247.61,81.3 253.93,81.3 | 253.93,81.3 254.37,80.87 | 254.37,80.87 254.37,78.64 Z28.A | 253.93,81.3 254.72,81.3 | 254.72,81.3 v260.46,81.3 261.59,80.18 Z29.A | Z30.A 96.22,18.8 97.85,17.17 102.27,17.17 | 102.27,17.17 103.39,18.28 103.39,20.78 Z31.A | 102.27,17.17 109.1,17.17 | Z32.A 110.25,18.31 109.1,17.17 | 109.1,17.17 116.16,17.17 | 116.16,17.17 117.38,18.39 117.38,21.05 Z33.A | 116.16,17.17 123.33,17.17 | 123.33,17.17 124.45,18.28 Z34.A | 123.33,17.17 130.69,17.17 | 130.69,17.17 131.48,17.95 131.48,21 Z35.A | 130.69,17.17 137.73,17.17 | Z36.A 138.47,17.9 137.73,17.17 | 137.73,17.17 144.81,17.17 | Z37.A 145.61,17.96 144.81,17.17 | 144.81,17.17 151.6,17.17 | Z38.A 152.77,18.34 151.6,17.17 | 151.6,17.17 158.84,17.17 | Z39.A 159.99,18.32 158.84,17.17 | 158.84,17.17 165.72,17.17 | Z40.A 167.02,18.47 165.72,17.17 | 165.72,17.17 172.91,17.17 | 172.91,17.17 173.92,18.18 173.92,21.07 Z41.A | 172.91,17.17 179.94,17.17 | 179.94,17.17 180.93,18.16 180.93,20.89 Z42.A | 179.94,17.17 186.52,17.17 | Z43.A 187.71,18.35 186.52,17.17 | 186.52,17.17 193.51,17.17 193.7,17.36 | 193.7,17.36 194.85,18.51 194.85,21.11 Z44.A | 193.7,17.36 201.14,17.36 | 201.14,17.36 202.09,18.31 202.09,20.81 Z45.A | 201.14,17.36 208.02,17.36
  Bottom 0.406: Z46.A 209.02,18.36 208.02,17.36 | 208.02,17.36 214.98,17.36 | 214.98,17.36 216.27,18.64 216.27,20.98 Z47.A | 214.98,17.36 221.94,17.36 | 221.94,17.36 223.12,18.54 223.12,20.97 Z48.A 224.02,20.99 224.7,21.66 224.7,26.82 226.05,28.17 227.14,28.17 228.43,29.46 228.43,31.29 227.57,32.15 227.57,35.4 v229.68,37.51 | Z6.A 77.38,82.06 76.95,81.63 | 76.95,81.63 76.95,75.18 | 76.95,75.18 77.35,74.77 | 77.35,74.77 81.03,74.77 Z5.A | 76.95,75.18 76.95,74.39 | 76.95,74.39 76.95,68.02 | 76.95,68.02 77.33,67.64 | 77.33,67.64 81.04,67.64 Z4.A | 76.95,68.02 76.95,67.26 | 76.95,67.26 76.95,61.24 | 76.95,61.24 77.4,60.78 | 77.4,60.78 80.93,60.78 Z3.A | 76.95,61.24 76.95,60.32 | 76.95,60.32 76.95,54.25 | 77.36,53.84 Z2.A | 76.95,54.25 77.36,53.84 | 76.95,54.25 76.95,53.41 | 76.95,53.41 76.95,48.1 78.42,46.63 Z1.A | 76.95,81.63 76.95,83.18 78.14,84.38 96.33,84.38 97.65,83.05 97.65,81.76 | 221.94,17.36 221.94,15.71 223.53,14.12 | v178.57,42.19 176.46,42.19 176.41,42.14 176.39,42.14 v176.34,42.19 | 97.65,81.76 v97.62,81.73 | 109,81.3 108.09,81.3 | 108.09,81.3 98.11,81.3 97.65,81.76 | v218.1,41.96 218.61,42.47 v222.84,42.47 | 76.95,53.41 77.36,53.83 77.36,53.84 | 77.4,60.78 76.95,60.32 | 77.33,67.64 76.95,67.26 | 77.35,74.77 77.33,74.77 76.95,74.39 | 254.37,80.87 254.72,81.23 254.72,81.3 | 247.12,80.81 247.12,81.01 247.41,81.3 | 247.12,80.7 247.12,80.81 | 247.12,80.81 247.61,81.3 | 240.19,80.77 240.19,80.84 240.65,81.3 | 233.16,80.87 233.21,80.87 233.64,81.3 | 226.26,80.88 226.69,81.3 | 219.62,80.87 219.64,80.87 220.08,81.3 | 212.88,80.85 213.33,81.3 | 206.03,80.77 206.03,80.92 206.41,81.3 | 199.35,80.79 199.81,81.25 199.81,81.3 | 192.16,80.75 192.69,81.29 192.69,81.3
  Bottom 0.406: 185.35,80.95 185.53,80.95 185.89,81.3 | 178.52,80.74 179.08,81.3 | 171.66,80.87 171.69,80.87 172.12,81.3 | 164.65,80.79 165.16,81.3 | 157.67,80.84 157.74,80.84 158.2,81.3 | 150.62,80.83 151.1,81.3 | 143.66,80.84 144.13,81.3 | 136.66,80.88 136.69,80.88 137.12,81.3 | 129.61,80.86 129.67,80.86 130.11,81.3 | 122.53,80.85 122.98,81.3 | 115.53,80.79 115.99,81.25 115.99,81.3 | 108.55,80.85 108.09,81.3
  Bottom 1.016: HEADER-22P1.20 243.65,10.66 242.22,12.1 225.55,12.1 223.53,14.12
COMMON
  Top 0.406: K1.COM 79.6,84.76 83.2,88.36 98.49,88.36 108.01,78.84 252.74,78.84 261.62,87.72 266.38,87.72 J2.2
GND  (via drill 0.6)
  Top 0.2: 103.31,48.52 100.72,51.1 OPTO6.3 | v160.92,36.88 159.37,36.88 158.58,37.66 158.58,40.76 158.19,41.16 156,41.16 155.38,40.53 155.38,37.92 154.85,37.39 152.71,37.39 v152.39,37.71 | v152.22,50.03 152.75,49.49 OPTO34.3 | v141.48,55.35 141.48,55.43
  Top 0.406: 101.1,55.06 100.72,54.69 | 107.79,55.06 107.35,55.06 | 107.35,55.06 101.1,55.06 | 107.79,55.06 107.79,54.73 | 107.79,54.73 OPTO5.3 | 107.79,55.06 108.12,55.06 | 108.12,55.06 114.51,55.06 | 114.51,55.06 114.89,55.06 | 114.89,55.06 114.89,54.68 | 114.89,54.68 114.89,52.61 OPTO4.3 | 114.89,55.06 115.28,55.06 | 115.28,55.06 121.65,55.06 | 121.65,55.06 121.96,55.06 | 121.96,55.06 121.98,55.04 121.98,54.73 | 121.98,54.73 121.98,52.63 OPTO7.3 | 121.96,55.06 122.31,55.06 | 122.31,55.06 128.64,55.06 | 128.64,55.06 128.92,55.06 | OPTO8.3 129.01,54.63 | 129.01,54.63 129.01,54.97 | 128.92,55.06 129.01,54.97 | OPTO9.3 136.04,55.06 | 135.67,55.43 136.41,55.43 | 136.41,55.43 141.48,55.43 142.76,55.43 | 142.76,55.43 143.46,55.43 | OPTO10.3 143.13,55.02 143.09,55.06 | OPTO11.3 150.2,54.69 | 150.58,55.06 156.78,55.06 | 156.78,55.06 157.77,55.06 | 171.48,55.58 OPTO14.3 | 171.03,56.03 171.48,55.58 | 171.03,56.03 170.47,56.03 169.71,56.79 v166.41,56.79 | 171.03,56.03 171.92,56.03 | 171.92,56.03 178.09,56.03 | OPTO15.3 178.57,55.55 | 178.09,56.03 178.57,55.55 | 178.09,56.03 178.98,56.03 | 178.98,56.03 184.54,56.03 185.51,55.06 | 185.69,54.66 185.69,54.88 185.51,55.06 | 185.69,54.66 OPTO16.3 | 185.51,55.06 186.09,55.06 | 186.09,55.06 192.26,55.06 | 220.08,55.7 220.1,55.67 220.66,55.67 221.09,55.24 | OPTO21.3 221.09,55.24 | 220.08,55.7 221.55,55.7 | 221.55,55.7 227.44,55.7 | 227.44,55.7 227.75,55.7 228.21,55.24 | OPTO22.3 228.21,55.24 | 227.44,55.7 227.39,55.75 228.66,55.75 | 228.66,55.75 234.76,55.75 | OPTO23.3 235.28,55.22 | 234.76,55.75 235.28,55.22 | 234.76,55.75 235.72,55.75 | 235.72,55.75 241.89,55.75 | OPTO24.3 242.4,55.24 | 241.89,55.75 242.4,55.24 | 241.89,55.75 242.83,55.75
  Top 0.406: 242.83,55.75 249.08,55.75 | 249.52,55.32 OPTO25.3 | 249.08,55.75 249.52,55.32 | 256.6,56.03 256.14,56.03 256.14,56 256.6,55.55 | 256.6,56.03 257.16,56.03 | 257.16,56.03 262.52,56.03 263.75,54.79 OPTO27.3 263.75,50.93 266.3,48.39 OPTO29.3 266.35,47.95 266.35,45.36 265,44 | 108.44,43.94 104.53,43.94 103.31,45.16 OPTO1.3 103.31,48.52 | 108.44,43.94 109.97,43.94 110.31,44.28 | 110.31,44.28 OPTO2.3 | 108.44,43.94 108.42,43.91 110.68,43.91 | 110.68,43.91 115.91,43.91 | 115.91,43.91 117.03,43.91 117.41,44.29 | 115.91,43.91 115.86,43.86 117.76,43.86 | 117.41,44.29 117.41,47.99 OPTO3.3 | 117.76,43.86 122.67,43.86 122.69,43.89 124.11,43.89 | 124.57,44.34 124.11,43.89 | 124.57,44.34 124.57,48.04 OPTO30.3 | 124.11,43.89 125.03,43.89 | 125.03,43.89 129.63,43.89 | 129.63,43.89 131.15,43.89 131.56,44.29 | 131.56,44.29 OPTO31.3 | 129.63,43.89 129.6,43.86 131.84,43.86 | 131.84,43.86 136.84,43.86 136.86,43.88 138.18,43.88 | 138.57,44.27 OPTO32.3 | 138.57,44.27 138.18,43.88 | 138.18,43.88 138.9,43.88 | 138.9,43.88 142.45,43.88 | 142.86,43.88 142.45,43.88 | 142.86,43.88 143.26,43.88 | 152.33,43.81 152.79,44.27 | 152.79,44.27 152.79,48.08 OPTO34.3 | 152.33,43.81 153.17,43.81 | 153.17,43.81 159.52,43.81 | 159.52,43.81 159.9,44.19 | 159.9,44.19 159.9,48.05 OPTO35.3 | 159.52,43.81 160.23,43.81 | 160.23,43.81 164.91,43.81 | 164.91,43.81 166.58,43.81 166.96,44.19 | 164.91,43.81 164.88,43.79 167.37,43.79 | 166.96,44.19 166.96,48.01 OPTO36.3 | 167.37,43.79 172.55,43.79 173.96,45.2 173.96,45.23 | 173.96,45.23 173.96,45.63 | 173.96,45.63 OPTO37.3 | 187.97,43.05 188.38,43.46 | 188.38,43.46 OPTO39.3 | 187.97,43.05 185.63,43.05 184.7,42.12 180.37,42.12 179.33,43.15 179.33,44.88
  Top 0.406: 187.97,43.05 188.73,43.05 | 188.73,43.05 194.7,43.05 | 195.23,43.57 OPTO40.3 | 194.7,43.05 195.23,43.57 | 194.7,43.05 195.59,43.05 | 195.59,43.05 201.94,43.05 | 201.94,43.05 202.37,43.48 | 202.37,43.48 202.37,48 OPTO41.3 | 201.94,43.05 202.8,43.05 | 202.8,43.05 v205.21,43.05 205.9,43.74 206.97,43.74 | 206.97,43.74 207.53,43.74 | 207.53,43.74 207.48,43.68 207.86,43.68 | 207.86,43.68 216.04,43.68 | 216.52,44.17 OPTO43.3 | 216.52,44.17 216.04,43.68 | 228.78,43.8 224.24,43.8 | 228.78,43.8 230.41,43.8 230.75,44.15 | OPTO45.3 230.75,44.15 | 228.78,43.8 228.66,43.68 231.15,43.68 | 231.15,43.68 235.98,43.68 236,43.71 237.37,43.71 | 237.37,43.71 237.77,44.1 | 237.77,44.1 237.91,44.24 | 237.91,44.24 237.91,47.87 OPTO46.3 | 237.37,43.71 237.96,43.71 | 238.41,43.71 237.96,43.71 | 238.41,43.71 243.77,43.71 243.8,43.68 244.51,43.68 | 244.51,43.68 244.97,44.14 | 244.97,44.14 244.97,47.92 OPTO47.3 | 244.51,43.68 245.43,43.68 | 245.43,43.68 251.11,43.68 | OPTO48.3 251.54,47.54 251.54,44.11 | 251.11,43.68 251.54,44.11 | 251.11,43.68 251.97,43.68 | 251.97,43.68 257.19,43.68 | 257.19,43.68 258.76,43.68 259.24,44.17 | 257.19,43.68 257.13,43.63 259.7,43.63 | 259.24,44.17 259.24,48.01 OPTO28.3 | 259.7,43.63 264.63,43.63 | 264.63,43.63 265,44 | OPTO13.3 163.73,52.59 161.61,54.71 | 161.61,54.71 161.26,55.05 | 161.26,55.05 161.25,55.06 157.77,55.06 | v162.3,56.09 161.61,55.39 | 161.61,55.39 161.26,55.05 | v218.61,43.79 218.5,43.68 216.93,43.68 | 216.93,43.68 216.04,43.68 | 129.01,54.97 129.11,55.06 | v131.68,55.7 129.74,55.7 129.11,55.06 | v134.02,56.46 134.65,56.46 135.67,55.43 | 135.67,55.43 136.04,55.06 | OPTO20.3 214.01,53.83 214,53.84 214,55.31
  Top 0.406: 214,55.31 214,55.7 | v82.61,25.02 82.61,24.94 80.7,23.03 U49.2 | 101.1,55.06 100.39,55.06 | 100.39,55.06 98.61,55.06 v98.59,55.09 | v266.15,42.63 265.63,42.63 265,43.27 | 265,43.27 264.63,43.63 | 143.46,55.43 144.49,56.46 148.91,56.46 150.2,55.16 | 143.46,55.43 143.09,55.06 | OPTO38.3 181.06,46.96 179.33,45.23 | 179.33,45.23 178.98,45.23 | 178.98,45.23 174.36,45.23 | 174.36,45.23 173.96,45.23 | 179.33,44.88 179.33,45.23 | 220.08,55.7 214.39,55.7 | 214.39,55.7 214,55.7 | 197.01,56.31 196.66,56.31 | OPTO18.3 197.52,52.6 196.66,53.46 196.66,55.95 | 196.66,55.96 196.66,56.31 | TTL-RS1.GND 241.21,16.23 242.99,18.01 242.99,27.63 240.98,29.64 231.3,29.64 229.42,31.52 SV1.10 | OPTO6.3 100.72,54.69 | 157.77,55.06 157.29,54.59 | OPTO12.3 157.29,54.59 | JP2.2 254.7,35.23 254.04,34.57 254.04,17.83 v253.93,17.73 | v89.16,31.98 91.63,31.98 v92.62,32.97 | 206.52,56.81 206.93,56.4 | OPTO19.3 206.93,55.48 | 206.93,55.48 206.93,55.8 | 206.93,55.8 206.93,56.12 | 206.93,56.12 206.93,56.4 | 207.43,56.81 212.89,56.81 214,55.7 | 207.43,56.81 206.52,56.81 | 206.52,56.81 197.51,56.81 197.01,56.31 | 107.79,54.73 108.12,55.06 | 107.79,54.73 107.68,54.73 107.35,55.06 | 100.72,54.69 100.72,54.73 100.39,55.06 | 114.89,54.68 114.51,55.06 | 114.89,54.68 115.28,55.06 | 121.98,54.73 121.65,55.06 | 121.98,54.73 122.31,55.06 | 129.01,54.63 128.64,55.01 128.64,55.06 | 128.92,55.06 129.11,55.06 | 136.04,55.06 136.04,55.07 136.41,55.43 | 143.09,55.06 142.76,55.39 142.76,55.43 | 150.2,54.69 150.58,55.06 | 150.2,54.69 150.2,55.16 | 150.2,55.16 150.3,55.06 150.58,55.06 | 157.29,54.59 157.26,54.59 156.78,55.06 | 161.61,55.39 161.61,54.71 | 174.36,45.23 173.96,45.63
  Top 0.406: 178.98,45.23 179.33,44.88 | 188.38,43.46 188.38,43.4 188.73,43.05 | 195.59,43.05 195.23,43.41 195.23,43.57 | 202.8,43.05 202.37,43.48 | 216.93,43.68 216.52,44.09 216.52,44.17 | OPTO42.3 209.48,47.74 207.53,45.79 207.53,44.22 | 207.53,44.22 207.53,44.01 | 207.53,44.01 207.53,43.74 | 207.86,43.68 207.53,44.01 | 206.97,43.74 207.45,44.22 207.53,44.22 | 110.68,43.91 110.31,44.28 | 117.76,43.86 117.41,44.22 117.41,44.29 | 125.03,43.89 124.57,44.34 | 131.84,43.86 131.56,44.14 131.56,44.29 | 138.9,43.88 138.57,44.21 138.57,44.27 | OPTO33.3 142.86,45.35 142.86,44.32 | 142.86,44.29 142.86,43.88 | v142.83,42.63 142.83,43.46 | 142.83,43.46 142.83,43.85 142.86,43.88 | 142.45,43.88 142.86,44.29 | 142.86,44.29 142.86,44.32 | 142.86,44.32 143.3,43.88 | 142.45,43.88 142.45,43.83 142.83,43.46 | 142.83,43.46 143.26,43.88 | 143.3,43.88 143.26,43.88 | 153.17,43.81 152.79,44.19 152.79,44.27 | 160.23,43.81 159.9,44.14 159.9,44.19 | 167.37,43.79 166.96,44.19 | 171.48,55.58 171.92,56.01 171.92,56.03 | 178.57,55.55 178.57,55.62 178.98,56.03 | 186.09,55.06 185.69,54.66 | 192.76,55.56 193.51,56.31 196.31,56.31 | 192.76,55.56 192.26,55.06 | 196.66,56.31 196.31,56.31 | OPTO17.3 192.76,54.63 | 192.76,54.63 192.76,55.56 | 192.26,55.06 192.69,54.63 192.76,54.63 | 196.66,55.95 196.31,56.31 | 197.01,56.31 196.66,55.96 | 196.66,55.96 196.66,55.95 | v206.01,55.79 206.02,55.8 206.61,55.8 | 206.61,55.8 206.93,55.8 | 206.93,56.4 207.02,56.4 207.43,56.81 | 206.61,55.8 206.93,55.48 | 206.93,56.12 206.61,55.8 | 214,55.31 214.39,55.7 | 221.09,55.24 221.55,55.7 | 228.21,55.24 228.21,55.3 228.66,55.75 | 235.28,55.22 235.28,55.31 235.72,55.75 | 242.4,55.24 242.4,55.31 242.83,55.75
  Top 0.406: 249.08,55.75 249.84,55.75 | 249.84,55.75 251.57,55.75 v251.8,55.98 | 249.52,55.32 249.84,55.64 249.84,55.75 | 265,43.27 265,44 | 257.16,56.03 256.64,55.51 | OPTO26.3 256.64,55.51 | 256.64,55.51 256.6,55.55 | 256.6,55.55 256.6,56.03 | 259.24,44.17 259.24,44.09 259.7,43.63 | 251.54,44.11 251.97,43.68 | 244.97,44.14 245.43,43.68 | 237.91,44.24 238.41,43.74 238.41,43.71 | 237.96,43.71 237.77,43.9 237.77,44.1 | 230.75,44.15 230.75,44.08 231.15,43.68 | 224.24,43.8 223.68,44.37 | 223.68,44.37 OPTO44.3 | v222.65,43.8 223.23,43.8 | 223.23,43.8 224.24,43.8 | 223.23,43.8 223.68,44.25 223.68,44.37 | 143.3,43.88 143.37,43.81 152.33,43.81
  Bottom 0.2: R106.1 139.68,36.48 140.23,37.03 140.21,37.04 140.21,38.93 140.68,39.4 141.73,39.4 142.83,40.5 v142.83,42.63 | R114.1 196.12,37.55 195.81,37.86 195.81,40.41 196.95,41.54 203.54,41.54 205.04,43.05 v205.21,43.05 | R110.1 166.44,36.91 166,36.47 161.25,36.47 160.92,36.8 v160.92,36.88 | v152.22,50.03 152.44,49.81 152.44,37.76 v152.39,37.71 | IC4.10 140.93,54.91 141.48,55.46 v141.48,55.35 | v166.41,56.79 166.41,53.11 166.78,52.73 172.9,52.73 173.2,53.03 IC1.10 | IC5.10 205.19,54.95 205.61,55.37 206.01,55.77 v206.01,55.79
  Bottom 0.406: v162.3,56.09 162.98,56.77 166.38,56.77 v166.41,56.79 | v134.02,56.46 133.26,55.7 v131.68,55.7 | v82.61,25.02 87.23,25.02 87.89,25.68 87.89,28.22 | Q1.2 87.2,28.91 87.89,28.22 | v98.59,55.09 94.52,55.09 91.75,52.31 91.75,34.76 92.62,33.89 v92.62,32.97 | R110.1 R109.1 | R104.1 R105.1 | R105.1 | R106.1 138.69,36.5 R105.1 | v266.15,42.63 263.45,39.93 JP2.8 | TTL-RS1.GND 228.91,14.2 250.4,14.2 v253.93,17.73 | v251.8,55.98 251.95,56.13 255.94,56.13 255.94,56.05 v255.92,56.03 | R114.1 R112.1 | 87.89,28.22 87.89,30.83 89.04,31.98 v89.16,31.98 | v218.61,43.79 222.63,43.79 v222.65,43.8
  Bottom 1.016: JP2.2 JP2.4 JP2.6 JP2.8
N$1
  Bottom 0.2: D2.A 80.8,41 81.85,39.95 89.24,39.95 90.35,41.06 R1.2
N$2  (via drill 0.6)
  Top 0.2: LED1.+ 90.59,45.39 v90.38,45.59
  Bottom 0.2: v90.38,45.59 87.75,42.95 D2.C
N$3
  Bottom 0.2: D3.A 80.93,49.1 81.6,48.43 88.35,48.43 R2.2
N$4  (via drill 0.6)
  Top 0.2: LED2.+ 90.18,52.55 v90.16,52.57
  Bottom 0.2: v90.16,52.57 87.89,50.31 D3.C
N$5
  Bottom 0.2: D4.A 80.84,56.33 81.54,55.62 88.5,55.62 R3.2
N$6  (via drill 0.6)
  Top 0.2: LED3.+ 90.5,59.49 90.41,59.58 v90.42,59.6
  Bottom 0.2: v90.42,59.6 88.21,57.39 D4.C
N$7
  Bottom 0.2: D5.A 80.8,63.5 81.67,62.63 88.51,62.63 R4.2
N$8  (via drill 0.6)
  Top 0.2: LED4.+ 90.27,66.33 90.13,66.47 v90.1,66.47
  Bottom 0.2: v90.1,66.47 87.83,64.2 D5.C
N$9
  Bottom 0.2: D6.A 80.82,70.14 81.57,69.39 88.47,69.39 R5.2
N$10  (via drill 0.6)
  Top 0.2: LED5.+ 90.82,73.5 v90.49,73.83
  Bottom 0.2: v90.49,73.83 87.94,71.29 D6.C
N$11
  Bottom 0.2: D7.A 80.82,77.56 81.7,76.68 88.54,76.68 R6.2
N$12  (via drill 0.6)
  Top 0.2: LED6.+ 90.3,80.78 v90.21,80.69
  Bottom 0.2: v90.21,80.69 88.05,78.53 D7.C
N$13
  Bottom 0.2: D8.A 102.79,78.73 101.76,77.7 101.76,72.87 103.54,71.09 104.87,71.09 R7.2
N$14  (via drill 0.6)
  Top 0.2: LED7.+ 106.81,70.88 v106.96,71.03
  Bottom 0.2: v106.96,71.03 106.96,73.23 105.74,74.46 D8.C
N$15
  Bottom 0.2: D9.A 110.87,78.72 110.14,78 110.14,72.87 R8.2
N$16  (via drill 0.6)
  Top 0.2: LED8.+ 114.11,70.91 v114.14,70.95
  Bottom 0.2: v114.14,70.95 114.14,71.6 112,73.74 D9.C
N$17
  Bottom 0.2: D15.A 153.03,78.44 152.26,77.67 152.26,73.06 R14.2
N$18  (via drill 0.6)
  Top 0.2: v90.35,47.35 90.38,47.32 91.47,48.41 LED1.- 93.03,48.49 94.22,48.49 95.03,47.67 95.03,41.65 97.13,39.55 OPTO1.1
  Bottom 0.2: v90.35,47.35 89.62,46.63 Z1.C
N$19  (via drill 0.6)
  Top 0.2: v151.43,71.04 152.25,70.22 LED13.- 155.11,65.48 159.67,65.48 160.28,64.87 160.28,63.14 160.69,62.73 166.13,62.73 166.96,61.9 166.96,61.14 OPTO13.1
  Bottom 0.2: Z13.C 151.43,73.69 v151.43,71.04
N$20
  Bottom 0.2: D10.A 117.98,78.73 117.18,77.92 117.18,73.01 R9.2
N$21  (via drill 0.6)
  Top 0.2: v158.42,71.09 159.22,70.29 LED14.- 159.22,68.27 160.79,66.7 160.79,63.67 161.21,63.26 166.77,63.26 167.87,62.16 170.32,62.16 170.81,62.65 172.89,62.65 172.9,62.66 173.75,62.66 174.02,62.38 OPTO14.1
  Bottom 0.2: Z14.C 158.42,73.73 v158.42,71.09
N$22  (via drill 0.6)
  Top 0.2: LED9.+ 121.17,68.5 121.17,71.05 v121.27,70.95
  Bottom 0.2: v121.27,70.95 121.27,71.84 118.95,74.16 D10.C
N$23  (via drill 0.6)
  Top 0.2: v165.49,71.08 166.16,70.42 LED15.- 168.13,66.37 180.22,66.37 181.71,64.87 188.03,64.87 188.74,64.17 188.74,63.23 188.21,62.71 184.43,62.71 184.09,62.37 184.09,61.88 183.29,61.08 OPTO15.1
  Bottom 0.2: v165.49,71.08 164.63,71.95 Z15.C
N$24
  Bottom 0.2: D11.A 124.85,78.51 124.32,77.97 124.32,72.06 125.16,71.22 R10.2
N$25  (via drill 0.6)
  Top 0.2: v172.2,71.14 173.24,70.1 LED16.- 174.71,66.87 180.71,66.87 181.9,65.68 189.04,65.68 189.75,64.97 189.75,62.6 OPTO16.1
  Bottom 0.2: v172.2,71.14 171.63,71.71 Z16.C
N$26  (via drill 0.6)
  Top 0.2: LED10.+ 128.14,71.05 v128.19,71
  Bottom 0.2: v128.19,71 v128.18,71.01 128.18,73 126.94,74.24 D11.C
N$27  (via drill 0.6)
  Top 0.2: v179.3,71.13 180.11,70.32 LED17.- 180.11,68.28 182.12,66.27 193.02,66.27 195.3,63.99 OPTO17.1
  Bottom 0.2: Z17.C 179.3,73.67 v179.3,71.13
N$28
  Bottom 0.2: D12.A 131.76,78.69 131.12,78.05 131.12,72.41 132.34,71.19 R11.2
N$29  (via drill 0.6)
  Top 0.2: v186.13,71.12 186.67,70.58 LED18.- 188.1,66.87 195.09,66.87 199.05,62.91 201.08,62.91 202.39,61.6 OPTO18.1
  Bottom 0.2: v186.13,71.12 186.1,71.15 | 186.1,71.15 | 186.1,71.15 185.32,71.93 Z18.C
N$30  (via drill 0.6)
  Top 0.2: LED11.+ 135.04,70.09 135.58,70.62 v135.58,71.06
  Bottom 0.2: v135.58,71.06 135.58,71.88 133.04,74.42 D12.C
N$31  (via drill 0.6)
  Top 0.2: v192.99,71.14 193.59,70.55 LED19.- 194.98,68.26 197.26,65.97 205.25,65.97 206.5,64.73 206.5,63.19 206.95,62.73 208.6,62.73 209.47,61.86 OPTO19.1
  Bottom 0.2: v192.99,71.14 192.16,71.98 Z19.C
N$32  (via drill 0.6)
  Top 0.2: v199.92,71.44 200.54,70.82 LED20.- 202.14,66.59 207.54,66.59 209.27,64.86 220.95,64.86 222.01,63.8 222.01,63.12 221.6,62.71 220.48,62.71 218.87,61.1 OPTO20.1
  Bottom 0.2: v199.92,71.44 199.08,72.27 Z20.C
N$33  (via drill 0.6)
  Top 0.2: OPTO21.1 223.64,63.01 221.01,65.64 215.99,65.64 215.14,66.48 209.44,66.48 LED21.- 207.7,68.61 206.75,69.56 v206.75,71.41
  Bottom 0.2: v206.75,71.41 206.03,72.13 Z21.C
N$34  (via drill 0.6)
  Top 0.2: LED14.+ 156.2,70.43 v156.75,70.98
  Bottom 0.2: D15.C 154.21,74.17 156.75,71.64 v156.75,70.98
N$35  (via drill 0.6)
  Top 0.2: OPTO22.1 230.75,62.68 228.86,64.56 223.91,64.56 222.11,66.36 216.25,66.36 LED22.- 214.37,70.58 v213.57,71.38 v213.56,71.38
  Bottom 0.2: v213.56,71.38 212.88,72.07 Z22.C
N$36
  Bottom 0.2: D13.A 138.94,78.65 138.26,77.97 138.26,72.1 139.19,71.17 R12.2
N$37  (via drill 0.6)
  Top 0.2: OPTO23.1 237.82,62.18 235.47,64.54 229.7,64.54 228.76,65.48 224.12,65.48 LED23.- 221.35,70.53 v220.75,71.13 v220.75,71.14
  Bottom 0.2: v220.75,71.14 219.62,72.26 Z23.C
N$38  (via drill 0.6)
  Top 0.2: LED12.+ 142.2,68.37 142.2,70.67 v142.61,71.07
  Bottom 0.2: v142.61,71.07 142.61,72.02 140.25,74.38 D13.C
N$39  (via drill 0.6)
  Top 0.2: OPTO24.1 244.94,62.18 242.63,64.49 236.46,64.49 235.54,65.4 230.73,65.4 LED24.- 227.88,70.71 227.49,71.11 v227.49,71.14
  Bottom 0.2: v227.49,71.14 226.26,72.36 Z24.C
N$40
  Bottom 0.2: D14.A 146.34,78.46 145.35,77.47 145.35,72.9 R13.2
N$41  (via drill 0.6)
  Top 0.2: OPTO25.1 252.06,62.53 250.33,64.26 243.62,64.26 242.71,65.17 237.78,65.17 LED25.- 234.71,70.57 v234.18,71.09
  Bottom 0.2: v234.18,71.09 233.14,72.13 Z25.C
N$42  (via drill 0.6)
  Top 0.2: LED13.+ 149.24,70.57 149.64,70.98 v149.64,71.03
  Bottom 0.2: D14.C 147.22,74.19 149.64,71.77 v149.64,71.03
N$43  (via drill 0.6)
  Top 0.2: OPTO26.1 259.18,61.6 256.78,64 251.34,64 250.3,65.05 244.78,65.05 LED26.- 241.6,70.35 v240.91,71.04
  Bottom 0.2: v240.91,71.04 240.19,71.76 Z26.C
N$44
  Bottom 0.2: D16.A 160.04,78.34 159.34,77.64 159.34,72.98 R15.2
N$45  (via drill 0.6)
  Top 0.2: OPTO27.1 266.3,63.81 265.36,64.74 251.76,64.74 248.69,67.81 LED27.- 248.69,70.47 v248.08,71.08